# Altium project Common_Sensor_Box.PrjPCB (part 10 of 17)

## Sheet Sensor_Box_CAN_Switch.SchDoc: Title
size 420 x 297 mm; Author: G.Kasprowicz; CompanyName: WUT ISE; DrawnBy: G.Kasprowicz; Organization: WUT ISE; Address1: PW ISE; Address2: Nowowiejska 15/19 00-665 Warsaw; Address3: gkasprow@gmail.com; Revision: 1.0; SheetNumber: -; SheetTotal: -; ModifiedBy: -; CheckedDate: -; Title2: Title2; DivGrp: WUT ISE; Designer: G.Kasprowicz; ModifiedDate: -; ProjectName: Sensor Box
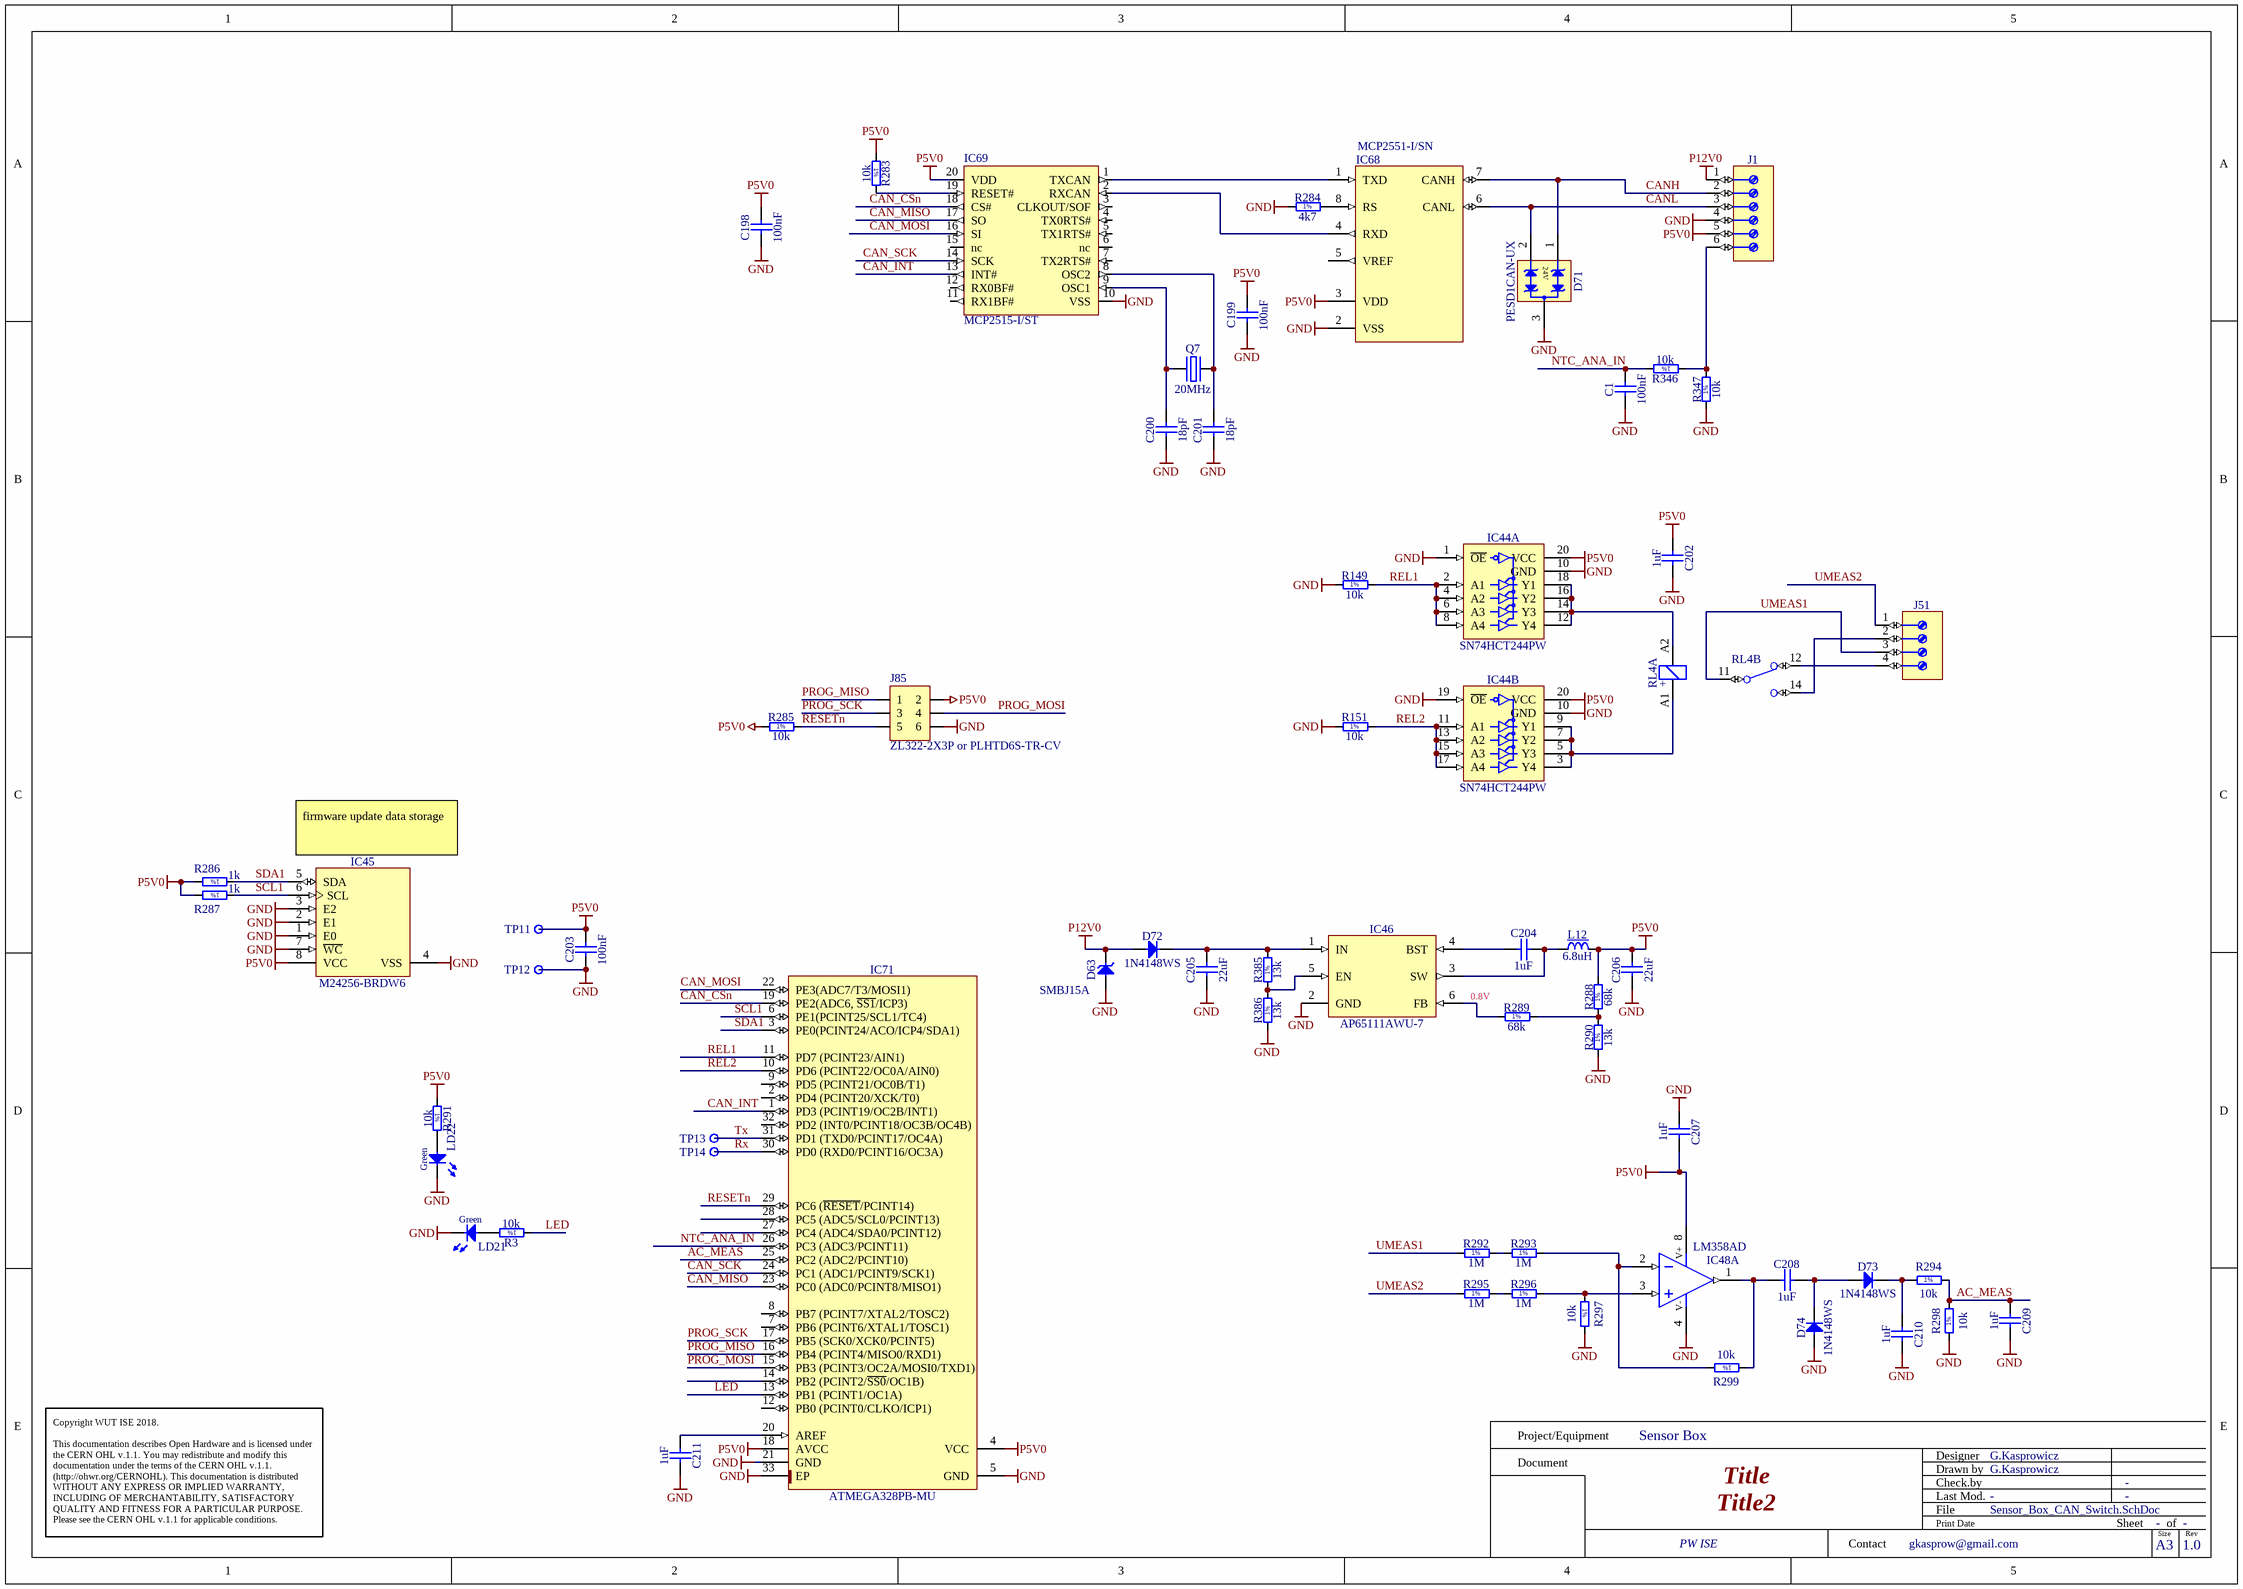
[diagram p15: Sensor_Box_CAN_Switch.SchDoc]

### Parts
C1  100nF  [CAPC1005X55N]
C198  100nF  [CAPC1005X55N]
C199  100nF  [CAPC1005X55N]
C200  18pF  [CAPC1005X55N]
C201  18pF  [CAPC1005X55N]
C202  1uF  [CAPC1005X55N]
C203  100nF  [CAPC1005X55N]
C204  1uF  [CAPC1005X55N]
C205  22uF  [CAPC1709X100N]
C206  22uF  [CAPC1709X100N]
C207  1uF  [CAPC1005X55N]
C208  1uF  [CAPC1005X55N]
C209  1uF  [CAPC1005X55N]
C210  1uF  [CAPC1005X55N]
C211  1uF  [CAPC1005X55N]
D63  SMBJ15A  [DIOM5336X265N]
D71  PESD1CAN-UX  [SOT95P237X112-3N]
D72  1N4148WS  [SODFL2512X100N]
D73  1N4148WS  [SODFL2512X100N]
D74  1N4148WS  [SODFL2512X100N]
IC44  SN74HCT244PW  [SOP65P640X120-20N]  (parts A,B of 2)
IC45  M24256-BRDW6  [SOP65P640X120-8N]
IC46  AP65111AWU-7  [SOT95P280X100-6N]
IC48  LM358AD  [SOIC127P600X175-8N]  (part A of 2)
IC68  MCP2551-I/SN  [SOIC127P600X175-8N]
IC69  MCP2515-I/ST  [SOP65P640X110-20N]
IC71  ATMEGA328PB-MU  [QFN50P500X500X100-33N-S325]
J1  (no value)  [PHOENIX_1725698]
J51  (no value)  [TYCO_282836-4]
J85  ZL322-2X3P or PLHTD6S-TR-CV  [ZL322-2X3P]
L12  6.8uH  [IND_WALSIN_WLPN3030]
LD21  Green  [LED_KINGBRIGHT_KPH-1608CGCK]
LD22  Green  [LED_KINGBRIGHT_KPH-1608CGCK]
Q7  20MHz  [XTAL1160X490X430]
R3  10k  [RESC1005X40N]
R149  10k  [RESC1005X40N]
R151  10k  [RESC1005X40N]
R283  10k  [RESC1005X40N]
R284  4k7  [RESC1005X40N]
R285  10k  [RESC1005X40N]
R286  1k  [RESC1005X40N]
R287  1k  [RESC1005X40N]
R288  68k  [RESC1005X40N]
R289  68k  [RESC1005X40N]
R290  13k  [RESC1005X40N]
R291  10k  [RESC1005X40N]
R292  1M  [RESC3216X65N]
R293  1M  [RESC3216X65N]
R294  10k  [RESC1005X40N]
R295  1M  [RESC3216X65N]
R296  1M  [RESC3216X65N]
R297  10k  [RESC1005X40N]
R298  10k  [RESC1005X40N]
R299  10k  [RESC1005X40N]
R346  10k  [RESC1005X40N]
R347  10k  [RESC1005X40N]
R385  13k  [RESC1005X40N]
R386  13k  [RESC1005X40N]
RL4  REL_TYCO_PE01  [REL_TYCO_PE01]  (value not drawn)  (parts A,B of 2)
TP11  Test Point  [TPS127]  (value not drawn)
TP12  Test Point  [TPS127]  (value not drawn)
TP13  Test Point  [TPS127]  (value not drawn)
TP14  Test Point  [TPS127]  (value not drawn)

### Nets
GND: C1.1 C198.1 C199.1 C200.1 C201.1 C202.2 C203.1 C205.1 C206.1 C207.1 C209.2 C210.2 C211.2 D63.2(A) D71.3(GND) D74.2(A) IC44.1(~{OE}) IC44.10(GND) IC44.19(~{OE}) IC45.1(E0) IC45.2(E1) IC45.3(E2) IC45.4(VSS) IC45.7(~{WC}) IC46.2(GND) IC48.4(V-) IC68.2(VSS) IC69.10(VSS) IC71.5(GND) IC71.21(GND) IC71.33(EP) J1.4 J85.6 LD21.1(C) LD22.1(C) R149.1 R151.1 R284.1 R290.1 R297.2 R298.1 R347.1 R386.1 TP12.1
P5V0: C198.2 C199.2 C202.1 C203.2 C206.2 C207.2 IC44.20(VCC) IC45.8(VCC) IC48.8(V+) IC68.3(VDD) IC69.20(VDD) IC71.4(VCC) IC71.18(AVCC) J1.5 J85.2 L12.2 R283.1 R285.1 R286.2 R287.2 R288.2 R291.1 TP11.1
P12V0: D63.1(C) D72.2(A) J1.1
AC_MEAS: C209.1 IC71.25(PC2_(ADC2/PCINT10)) R294.2 R298.2
CAN_CSn: IC69.18(CS#) IC71.19(PE2(ADC6,_~{SS1}/ICP3))
CAN_INT: IC69.13(INT#) IC71.1(PD3_(PCINT19/OC2B/INT1))
CAN_MISO: IC69.17(SO) IC71.23(PC0_(ADC0/PCINT8/MISO1))
CAN_MOSI: IC69.16(SI) IC71.22(PE3(ADC7/T3/MOSI1))
CAN_SCK: IC69.14(SCK) IC71.24(PC1_(ADC1/PCINT9/SCK1))
CANH: D71.1(I/O1) IC68.7(CANH) J1.2
CANL: D71.2(I/O2) IC68.6(CANL) J1.3
LED: IC71.13(PB1_(PCINT1/OC1A)) R3.1
NTC_ANA_IN: C1.2 IC71.26(PC3_(ADC3/PCINT11)) R346.2
PROG_MISO: IC71.16(PB4_(PCINT4/MISO0/RXD1)) J85.1
PROG_MOSI: IC71.15(PB3_(PCINT3/OC2A/MOSI0/TXD1)) J85.4
PROG_SCK: IC71.17(PB5_(SCK0/XCK0/PCINT5)) J85.3
REL1: IC44.2(A1) IC44.4(A2) IC44.6(A3) IC44.8(A4) IC71.11(PD7_(PCINT23/AIN1)) R149.2
REL2: IC44.11(A1) IC44.13(A2) IC44.15(A3) IC44.17(A4) IC71.10(PD6_(PCINT22/OC0A/AIN0)) R151.2
RESETn: IC71.29(PC6_(~{RESET}/PCINT14)) J85.5 R285.2
Rx: IC71.30(PD0_(RXD0/PCINT16/OC3A)) TP14.1
SCL1: IC45.6(SCL) IC71.6(PE1(PCINT25/SCL1/TC4)) R287.1
SDA1: IC45.5(SDA) IC71.3(PE0(PCINT24/ACO/ICP4/SDA1)) R286.1
Tx: IC71.31(PD1_(TXD0/PCINT17/OC4A)) TP13.1
UMEAS1: J51.3 R292.1 RL4.11(C)
UMEAS2: J51.1 R295.1
NetC200_2: C200.2 IC69.9(OSC1) Q7.1(OSC1)
NetC201_2: C201.2 IC69.8(OSC2) Q7.2(OSC2)
NetC204_1: C204.1 IC46.4(BST)
NetC204_2: C204.2 IC46.3(SW) L12.1
NetC205_2: C205.2 D72.1(C) IC46.1(IN) R385.2
NetC208_1: C208.1 IC48.1(OUT) R299.1
NetC208_2: C208.2 D73.2(A) D74.1(C)
NetC210_1: C210.1 D73.1(C) R294.1
NetC211_1: C211.1 IC71.20(AREF)
NetIC44_3: IC44.3(Y4) IC44.5(Y3) IC44.7(Y2) IC44.9(Y1) RL4.A1
NetIC44_12: IC44.12(Y4) IC44.14(Y3) IC44.16(Y2) IC44.18(Y1) RL4.A2
NetIC46_5: IC46.5(EN) R385.1 R386.2
NetIC46_6: IC46.6(FB) R289.1
NetIC48_2: IC48.2(IN-) R293.2 R299.2
NetIC48_3: IC48.3(IN+) R296.2 R297.1
NetIC68_1: IC68.1(TXD) IC69.1(TXCAN)
NetIC68_4: IC68.4(RXD) IC69.2(RXCAN)
NetIC68_8: IC68.8(RS) R284.2
NetIC69_19: IC69.19(RESET#) R283.2
NetJ1_6: J1.6 R346.1 R347.2
NetJ51_2: J51.2 RL4.14(NO)
NetJ51_4: J51.4 RL4.12(NC)
NetLD21_2: LD21.2(A) R3.2
NetLD22_2: LD22.2(A) R291.2
NetR288_1: R288.1 R289.2 R290.2
NetR292_2: R292.2 R293.1
NetR295_2: R295.2 R296.1

Not connected (* = marked no-connect by the designer): IC68 5(VREF); IC69 3(CLKOUT/SOF) 4(TX0RTS#) 5(TX1RTS#) 6(nc) 7(TX2RTS#) 11(RX1BF#) 12(RX0BF#) 15(nc); IC71 2(PD4_(PCINT20/XCK/T0)) 7(PB6_(PCINT6/XTAL1/TOSC1)) 8(PB7_(PCINT7/XTAL2/TOSC2)) 9(PD5_(PCINT21/OC0B/T1)) 12(PB0_(PCINT0/CLKO/ICP1)) 14(PB2_(PCINT2/~{SS0}/OC1B)) 27(PC4_(ADC4/SDA0/PCINT12)) 28(PC5_(ADC5/SCL0/PCINT13)) 32(PD2_(INT0/PCINT18/OC3B/OC4B))

### Notes on the sheet
- (near IC45) firmware update data storage
- 0.8V
- Project/Equipment
- Document
- Designer
- Drawn by
- Check.by
- Copyright WUT ISE 2018.
  This documentation describes Open Hardware and is licensed under the CERN OHL v.1.1. You may redistribute and modify this documentation under the terms of the CERN OHL v.1.1. (http://ohwr.org/CERNOHL). This documentation is distributed WITHOUT ANY EXPRESS OR IMPLIED WARRANTY, INCLUDING OF MERCHANTABILITY, SATISFACTORY QUALITY AND FITNESS FOR A PARTICULAR PURPOSE. Please see the CERN OHL v.1.1 for applicable conditions.
- Contact
- File
- Last Mod.
- Print Date
- Sheet
- Size
- A3
- of
- Rev
- (in symbol R0402_1K_1%_0.0625W_100PPM) 1%
- (in symbol R0402_4K7_1%_0.0625W_100PPM) 1%
- (in symbol R0402_10K_1%_0.0625W_100PPM) 1%
- (in symbol R0402_13K_1%_0.0625W_100PPM) 1%
- (in symbol R0402_68K_1%_0.0625W_100PPM) 1%
- (in symbol R1206_1M_1%_0.25W_100PPM) 1%
- (in symbol REL_TYCO_PE014F05, part A) +

### Library data of the parts
C1 C198 C199 C203 = CC0402_100NF_16V_10%_X5R: as C188#1 on sheet Sensor_Box_Smart_IO; Part Number: CC0402_100NF_16V_10%_X5R; Component Kind: Standard; Component Type: Standard; Pin Count: 2; Value: 100nF; Status: None; Manufacturer Part Number: CC0402_100NF_16V_10%_X5R; Case: 0402; Mounted: Yes; Socket: No; SMD: Yes; Sense: No; Manufacturer1 Example: MURATA; Manufacturer1 ComponentHeight: 0.55mm; HelpURL: \\cern.ch\dfs\Applications\Altium\Datasheets\CC0402_X5R_MURATA_GRM.pdf; Author: CERN DEM JLC; CreateDate: 10.12.2013; LatestRevisionDate: 10.12.2013
C200 C201 = CC0402_18PF_50V_5%_C0G: as C185 on sheet Sensor_Box_Smart_IO; Part Number: CC0402_18PF_50V_5%_C0G; Component Kind: Standard; Component Type: Standard; Pin Count: 2; Value: 18pF; Status: Preferred; Manufacturer Part Number: CC0402_18PF_50V_5%_C0G; Case: 0402; Mounted: Yes; Socket: No; SMD: Yes; Sense: No; Manufacturer1 Example: KEMET; Manufacturer1 ComponentHeight: 0.55mm; HelpURL: \\cern.ch\dfs\Applications\Altium\Datasheets\CC0805_C0G_KEMET_(Commercial Grade).pdf; Author: CERN DEM JLC; CreateDate: 04.10.2016; LatestRevisionDate: 04.10.2016
C202 C204 C207-C211 = CC0402_1UF_16V_10%_X5R: as C181-C183 on sheet Sensor_Box_Smart_IO; Part Number: CC0402_1UF_16V_10%_X5R; Component Kind: Standard; Component Type: Standard; Pin Count: 2; Value: 1uF; Status: Preferred; Manufacturer Part Number: CC0402_1UF_16V_10%_X5R; Case: 0402; Mounted: Yes; Socket: No; SMD: Yes; Sense: No; Manufacturer1 Example: TDK; Manufacturer1 ComponentHeight: 0.55mm; HelpURL: \\cern.ch\dfs\Applications\Altium\Datasheets\CC0402_X5R_TDK_C.pdf; Author: CERN DEM JLC; CreateDate: 25.10.2012; LatestRevisionDate: 25.10.2012
C205 C206 = CC0603_22UF_6.3V_20%_X5R: Non-polarised capacitor; Part Description: SMD Multilayer Chip Ceramic Capacitor; Manufacturer: GENERIC; Manufacturer1 Part Number: C1608X5R0J226M080AC; Voltage: 6.3V; TC: X5R; Tolerance: ±20%; Part Number: CC0603_22UF_6.3V_20%_X5R; Component Kind: Standard; Component Type: Standard; Pin Count: 2; Value: 22uF; Status: None; Manufacturer Part Number: CC0603_22UF_6.3V_20%_X5R; Case: 0603; Mounted: Yes; Socket: No; SMD: Yes; Sense: No; Manufacturer1 Example: TDK; Manufacturer1 ComponentHeight: 1mm; HelpURL: \\cern.ch\dfs\Applications\Altium\Datasheets\CC0603_X5R_TDK_C.pdf; Author: CERN DEM JLC; CreateDate: 16.12.2013; LatestRevisionDate: 13.09.2016
D63 = SMBJ15A: Zener Diode; Part Description: Uni-Directional Transient Voltage Suppressor Diode; Manufacturer: FAIRCHILD SEMICONDUCTOR; Voltage: 15V; Power: 600W; PressFit: No; Bonding: No; Part Number: SMBJ15A; Component Kind: Standard; Component Type: Standard; Device: SMBJ15A; PackageDescription: DO-214-AA/SMB Diode, Molded Body; 5.34mm L X 3.625mm W X 2.65mm H, IPC Medium Density; Manufacturer Part Number: SMBJ15A; Pin Count: 2; Case: DO-214AA; Mounted: Yes; Socket: No; SMD: Yes; Sense: No; ComponentHeight: 2.65mm; HelpURL: \\cern.ch\dfs\Applications\Altium\Datasheets\SMBJ.pdf; Author: CERN DEM JLC; CreateDate: 08.12.2008; LatestRevisionDate: 19.12.2011
D71 = D_TVS_PESD1CAN: as D35 on sheet Sensor_Box_Hub_OrangePi; Part Number: PESD1CAN-UX; Component Kind: Standard; Component Type: Standard; Device: PESD1CAN-UX; PackageDescription: SOT, 0.95mm, pitch; 3 pin,1.30mm W X 2.92mm L X 1.12mm H body, IPC Medium Density; Part Description: TVS Diode for CAN; Manufacturer Part Number: PESD1CAN-UX; Pin Count: 3; Case: SOT-23; Mounted: Yes; Socket: No; SMD: Yes; Sense: No; ComponentHeight: 1.12mm; HelpURL: \\cern.ch\dfs\Applications\Altium\Datasheets\SM712.TCT.pdf; Author: CERN DEM JLC; CreateDate: 03.09.2014; LatestRevisionDate: 13.01.2015
D72-D74 = 1N4148WS: as D56-D61 on sheet Sensor_Box_Smart_IO; Part Number: 1N4148WS; Component Kind: Standard; Component Type: Standard; Device: 1N4148WS; PackageDescription: SODFL Diode; 1.70mm W X 1.25mm L X 1.00mm H body, IPC Medium Density; Manufacturer Part Number: 1N4148WS; Pin Count: 2; Case: SOD-323F; Mounted: Yes; Socket: No; SMD: Yes; Sense: No; ComponentHeight: 1mm; HelpURL: \\cern.ch\dfs\Applications\Altium\Datasheets\1N4148WS.pdf; Author: CERN DEM JLC; CreateDate: 12.05.2011; LatestRevisionDate: 12.05.2011
IC44 = SN74HCT244PW: Octal Buffer/Driver with 3-State Ouputs; Part Description: Octal Buffer And Line Driver with 3-State Ouputs; Manufacturer: TEXAS INSTRUMENTS; PressFit: No; Bonding: No; Part Number: SN74HCT244PW; Component Kind: Standard; Component Type: Standard; Device: SN74HCT244PW; PackageDescription: SOP, 20-Leads, Body 6.5x4.4mm, Pitch 0.65mm, IPC Medium Density; Manufacturer Part Number: SN74HCT244PW; Pin Count: 20; Case: TSSOP20; Mounted: Yes; Socket: No; SMD: Yes; Sense: No; ComponentHeight: 1.2mm; Author: CERN DEM JLC; HelpURL: \\cern.ch\dfs\Applications\Altium\Datasheets\SN74HCT244PW.pdf; CreateDate: 11.10.2011; LatestRevisionDate: 11.10.2011
IC45 = MEM_M24256-BRDW6P: as IC76#1 on sheet Sensor_Box_Smart_IO; Part Number: M24256-BRDW6P; Component Kind: Standard; Component Type: Standard; Device: M24256-BRDW6; PackageDescription: SOP, 0.65mm pitch; 8 pin, 4.40mm W X 3.00mm L X 1.20mm H body, IPC Medium Density; Part Description: 256-Kbit Serial I²C Bus EEPROM; Manufacturer Part Number: M24256-BRDW6; Pin Count: 8; Case: TSSOP8; Mounted: Yes; Socket: No; SMD: Yes; Sense: No; ComponentHeight: 1.2mm; HelpURL: \\cern.ch\dfs\Applications\Altium\Datasheets\M24256-BRDW6P.pdf; Author: CERN DEM MR; CreateDate: 17.03.2016; LatestRevisionDate: 17.03.2016
IC46 = AP65111AWU-7: Light Load Improved 1.5A Synch DC/DC Buck Converter; Manufacturer: DIODES INCORPORATED; PressFit: No; Bonding: No; Part Number: AP65111AWU-7; Component Kind: Standard; Component Type: Standard; Device: AP65111AWU-7; PackageDescription: SOT23, 0.95mm pitch; 6 pin, 1.625mm W X 2.90mm L X 1.00mm H body, IPC Medium Density; Part Description: Light Load Improved 1.5A Synch DC/DC Buck Converter; Manufacturer Part Number: AP65111AWU-7; Pin Count: 6; Case: SOT23-6; Mounted: Yes; Socket: No; SMD: Yes; Sense: No; ComponentHeight: 1.1mm; HelpURL: \\cern.ch\dfs\Applications\Altium\Datasheets\AP65111AWU-7.pdf; Author: CERN DEM JLC; CreateDate: 20.03.2018; LatestRevisionDate: 20.03.2018
IC48 = LM358AD: as IC62 on sheet Sensor_Box_Smart_IO; Part Number: LM358AD; Component Kind: Standard; Component Type: Standard; Device: LM358AD; PackageDescription: SOIC 8, Pitch 1.27mm - Body 4x5mm, IPC Medium Density; Part Description: Dual Operational Amplifier; Manufacturer Part Number: LM358AD; Pin Count: 8; Case: SOIC8; Mounted: Yes; Socket: No; SMD: Yes; Sense: No; ComponentHeight: 1.75mm; Author: CERN DEM JLC; HelpURL: \\cern.ch\dfs\Applications\Altium\Datasheets\LM358AD.pdf; CreateDate: 02.12.2008; LatestRevisionDate: 13.04.2010
IC68 = IFC_MCP2551: as IC49 on sheet Sensor_Box_Hub_OrangePi; Part Number: MCP2551-I/SN; Component Kind: Standard; Component Type: Standard; Device: MCP2551-I/SN; PackageDescription: SOIC 8, Pitch 1.27mm - Body 4x5mm, IPC Medium Density; Part Description: High-Speed CAN Transceiver; Manufacturer Part Number: MCP2551-I/SN; Pin Count: 8; Case: SOIC8; Mounted: Yes; Socket: No; SMD: Yes; Sense: No; ComponentHeight: 1.75mm; Author: GK; CreateDate: 07.09.2016; LatestRevisionDate: 07.09.2016
IC69 = IFC_MCP2515_TSSOP: CAN Controller With SPI nterface; Manufacturer: Microchip; Manufacturer Part Number: MCP2515T-I/ST; Part Description: Stand-Alone CAN Controller with SPI Interface; Case: TSSOP20; Component Type: Standard; Device: MCP2515; Mounted: Yes; PackageDescription: TSSOP 20, Pitch 0.65mm - Body 4.5x6.5mm, IPC Medium Density; Part Number: MCP2515T-I/ST; Pin Count: 20; SMD: Yes
IC71 = UPC_ATMEGA328PB-MU: as IC81 on sheet Sensor_Box_Smart_IO; Part Number: ATMEGA328PB-MU; Component Kind: Standard; Component Type: Standard; Device: ATMEGA328PB-MU; PackageDescription: QFN, (MO-220-VHHD-2) 0.50mm pitch,square; 8 pin X 8 pin, 5mm X 5mm X 1.00mm H body (w/thermal tab 3.25 X 3.25mm),  IPC Medium Density; Manufacturer Part Number: ATMEGA328PB-MU; Pin Count: 33; Case: QFN32; Mounted: Yes; Socket: No; SMD: Yes; Sense: No; ComponentHeight: 1mm; HelpURL: \\cern.ch\dfs\Applications\Altium\Datasheets\ATMEGA328P-MU.pdf; Author: GK; CreateDate: 2011-02-08; LatestRevisionDate: 2014-07-02
J1 = PHOENIX_1725698: Terminal Block, 6 Positions, Screw Connection; Part Description: 6A, 63V, Terminal Block, Pitch 2.54mm, 6 Positions, Screw Connection; Manufacturer: PHOENIX CONTACT; Manufacturer Part Number: 1725698 (MPT 0,5/6-2,54); PressFit: No; Part Number: PHOENIX_1725698; Component Kind: Standard; Component Type: Standard; Pin Count: 6; Mounted: Yes; Socket: No; SMD: No; Sense: No; Status: None; ComponentHeight: 8.5mm; HelpURL: \\cern.ch\dfs\Applications\Altium\Datasheets\PHOENIX_1725698.pdf; Author: CERN DEM JMW; CreateDate: 07.11.2008; LatestRevisionDate: 26.04.2010
J51 = TYCO_282836-4: Terminal Block, 4 Positions, Screw Connection; Part Description: 15.5A, 300V, Terminal Block, Pitch 5mm, 4 Positions, Screw Connection; Manufacturer: TYCO ELECTRONICS; PressFit: No; Part Number: TYCO_282836-4; Component Kind: Standard; Component Type: Standard; Pin Count: 4; Mounted: Yes; Socket: No; SMD: No; Sense: No; Status: None; Manufacturer Part Number: 282836-4; ComponentHeight: 10mm; HelpURL: \\cern.ch\dfs\Applications\Altium\Datasheets\TYCO_282836-4.pdf; Author: CERN DEM JLC; CreateDate: 10.11.2014; LatestRevisionDate: 10.11.2014
J85 = CON_2x3 1.27 SMT Male: 1.27 mm dual row goldpin (Maritex)
L12 = IND_WLPN3030: 6,8uH; 900mA; 0,211Ω; 3x3x1,5mm; Part Number: IND_6.8UH_20%_WALSIN_WLPN303015M6R8PB; Part Description: Miniature Surface Mount Power Inductor (8200 Series); Manufacturer: WALSIN; Manufacturer Part Number: WLPN303015M6R8PB; Resistance: 0.21R; Tolerance: ±20%; Component Kind: Standard; Component Type: Standard; Pin Count: 2; Value: 6.8uH; Status: None; Power: 900mA; Mounted: Yes; Socket: No; SMD: Yes; Sense: No; ComponentHeight: 1.5; HelpURL: \\cern.ch\dfs\Applications\Altium\Datasheets\IND_MURATA-PS_8200.pdf; Author: GK; CreateDate: 11.07.2016; LatestRevisionDate: 11.07.2016
LD21 LD22 = LED_KINGBRIGHT_KPH-1608CGCK: as LD28 on sheet Sensor_Box_Smart_IO; Part Number: LED_KINGBRIGHT_KPH-1608CGCK; Component Kind: Standard; Component Type: Standard; Color: Green; PackageDescription: SMT Green LED, Case 0603, Body L 1.6 x W 0.8mm H 0.65mm; Manufacturer: KINGBRIGHT; Manufacturer Part Number: KPH-1608CGCK; Pin Count: 2; Mounted: Yes; Socket: No; SMD: Yes; Sense: No; ComponentHeight: 0.65mm; HelpURL: \\cern.ch\dfs\Applications\Altium\Datasheets\LED_KINGBRIGHT_KPH-1608CGCK.pdf; Author: CERN DEM JLC; CreateDate: 03.07.2017; LatestRevisionDate: 03.07.2017
Q7 = X_CRYSTAL_20M_HC49: Quartz Crystal 20MHz, 30ppm, 20pF; Part Number: SR PASSIVES 20M-49SMD-SR; Part Description: Tolerance:± 30ppm, Stability:± 50ppm, -10°C to +60°C, 20pF, Surface Mount Quartz Crystal, HC49/4HSMX Series; Manufacturer: SR PASSIVES; Manufacturer Part Number: 20M-49SMD-SR; PressFit: No; Bonding: No; Component Kind: Standard; Component Type: Standard; PackageDescription: HC49/4H SMX Case, SMD Cristal, Body 11.6x4.9mm; Value: 20MHz; Pin Count: 2; Mounted: Yes; Socket: No; SMD: Yes; Sense: No; ComponentHeight: 4.3mm; HelpURL: \\cern.ch\dfs\Applications\Altium\Datasheets\XTAL_IQD_LFXTAL003166.pdf; Author: GK; CreateDate: 19.04.2012; LatestRevisionDate: 07.11.2016
R3 R149 R151 R283 R285 R291 R346 R347 = R0402_10K_1%_0.0625W_100PPM: as R322#1 on sheet Sensor_Box_Smart_IO; Part Number: R0402_10K_1%_0.0625W_100PPM; Component Kind: Standard; Component Type: Standard; Pin Count: 2; Value: 10k; Status: Not Recommended; Power: 0.0625W; Tolerance: ±1%; Manufacturer Part Number: R0402_10K_1%_0.0625W_100PPM; Case: 0402; Mounted: Yes; Sense: No; Socket: No; SMD: Yes; Manufacturer1 Example: YAGEO PHYCOMP; Manufacturer1 ComponentHeight: 0.4mm; HelpURL: \\cern.ch\dfs\Applications\Altium\Datasheets\R0402_Phycomp_RC0402.pdf; Author: CERN DEM JLC; CreateDate: 03.12.2007; LatestRevisionDate: 17.10.2012
R284 = R0402_4K7_1%_0.0625W_100PPM: as R168 on sheet Sensor_Box_Hub_OrangePi; Part Number: R0402_4K7_1%_0.0625W_100PPM; Component Kind: Standard; Component Type: Standard; Pin Count: 2; Value: 4k7; Status: Not Recommended; Power: 0.0625W; Tolerance: ±1%; Manufacturer Part Number: R0402_4K7_1%_0.0625W_100PPM; Case: 0402; Mounted: Yes; Sense: No; Socket: No; SMD: Yes; Manufacturer1 Example: YAGEO PHYCOMP; Manufacturer1 ComponentHeight: 0.4mm; HelpURL: \\cern.ch\dfs\Applications\Altium\Datasheets\R0402_Phycomp_RC0402.pdf; Author: CERN DEM JLC; CreateDate: 03.12.2007; LatestRevisionDate: 17.10.2012
R286 R287 = R0402_1K_1%_0.0625W_100PPM: as R233 on sheet Sensor_Box_Smart_IO; Part Number: R0402_1K_1%_0.0625W_100PPM; Component Kind: Standard; Component Type: Standard; Pin Count: 2; Value: 1k; Status: Not Recommended; Power: 0.0625W; Tolerance: ±1%; Manufacturer Part Number: R0402_1K_1%_0.0625W_100PPM; Case: 0402; Mounted: Yes; Sense: No; Socket: No; SMD: Yes; Manufacturer1 Example: YAGEO PHYCOMP; Manufacturer1 ComponentHeight: 0.4mm; HelpURL: \\cern.ch\dfs\Applications\Altium\Datasheets\R0402_Phycomp_RC0402.pdf; Author: CERN DEM JLC; CreateDate: 03.12.2007; LatestRevisionDate: 17.10.2012
R288 R289 = R0402_68K_1%_0.0625W_100PPM: Resistor - 1%; Part Description: General Purpose Thick Film Chip Resistor; Manufacturer: GENERIC; Manufacturer1 Part Number: 232270676803L; TC: ±100ppm/°C; PressFit: No; Part Number: R0402_68K_1%_0.0625W_100PPM; Component Kind: Standard; Component Type: Standard; Pin Count: 2; Value: 68k; Status: Not Recommended; Power: 0.0625W; Tolerance: ±1%; Manufacturer Part Number: R0402_68K_1%_0.0625W_100PPM; Case: 0402; Mounted: Yes; Sense: No; Socket: No; SMD: Yes; Manufacturer1 Example: YAGEO PHYCOMP; Manufacturer1 ComponentHeight: 0.4mm; HelpURL: \\cern.ch\dfs\Applications\Altium\Datasheets\R0402_Phycomp_RC0402.pdf; Author: CERN DEM JLC; CreateDate: 03.12.2007; LatestRevisionDate: 17.10.2012
R290 R385 R386 = R0402_13K_1%_0.0625W_100PPM: Resistor - 1%; Part Description: General Purpose Thick Film Chip Resistor; Manufacturer: GENERIC; Manufacturer1 Part Number: 232270671303L; TC: ±100ppm/°C; PressFit: No; Part Number: R0402_13K_1%_0.0625W_100PPM; Component Kind: Standard; Component Type: Standard; Pin Count: 2; Value: 13k; Status: Not Recommended; Power: 0.0625W; Tolerance: ±1%; Manufacturer Part Number: R0402_13K_1%_0.0625W_100PPM; Case: 0402; Mounted: Yes; Sense: No; Socket: No; SMD: Yes; Manufacturer1 Example: YAGEO PHYCOMP; Manufacturer1 ComponentHeight: 0.4mm; HelpURL: \\cern.ch\dfs\Applications\Altium\Datasheets\R0402_Phycomp_RC0402.pdf; Author: CERN DEM JLC; CreateDate: 03.12.2007; LatestRevisionDate: 17.10.2012
R292 R293 R295 R296 = R1206_1M_1%_0.25W_100PPM: Resistor - 1%; Part Description: General Purpose Thick Film Chip Resistor; Manufacturer: GENERIC; Manufacturer1 Part Number: NRC12F1004TRF; Power: 0.25W; TC: ±100ppm/°C; PressFit: No; Part Number: R1206_1M_1%_0.25W_100PPM; Component Kind: Standard; Component Type: Standard; Pin Count: 2; Value: 1M; Status: Preferred; Tolerance: ±1%; Manufacturer Part Number: R1206_1M_1%_0.25W_100PPM; Case: 1206; Mounted: Yes; Sense: No; Socket: No; SMD: Yes; Manufacturer1 Example: NIC COMPONENT; Manufacturer1 ComponentHeight: 0.65mm; HelpURL: \\cern.ch\dfs\Applications\Altium\Datasheets\R1206_NIC_NRC.pdf; Author: CERN DEM JLC; CreateDate: 03.12.2007; LatestRevisionDate: 13.03.2008
R294 R297-R299 = R0402_10K_1%_0.0625W_100PPM: as R230 on sheet Sensor_Box_Smart_IO; Part Number: R0402_10K_1%_0.0625W_100PPM; Component Kind: Standard; Component Type: Standard; Pin Count: 2; Value: 10k; Status: Not recommended; Power: 0.0625W; Tolerance: ±1%; Manufacturer Part Number: R0402_10K_1%_0.0625W_100PPM; Case: 0402; Mounted: Yes; Socket: No; SMD: Yes; Manufacturer1 Example: YAGEO PHYCOMP; Manufacturer1 ComponentHeight: 0.4mm; HelpURL: \\cern.ch\dfs\Applications\Altium\Datasheets\R0402_Phycomp_RC0402.pdf; Author: CERN DEM JLC; CreateDate: 2007-12-03; LatestRevisionDate: 2012-10-17
RL4 = REL_TYCO_PE014F05: 1 form C (CO) General Purpose Low Power PCB Relay, PE Series; Part Description: 5A/250VAC 1 form C (CO) General Purpose Low Power PCB Relay, PE Series; Manufacturer: TYCO SCHRACK; Manufacturer Part Number: PE014F05 or 1-1415390-1; PressFit: No; Value: 5VDC; Part Number: REL_TYCO_PE014F05; Component Kind: Standard; Component Type: Standard; Pin Count: 5; PackageDescription: 1 form C (CO) General Purpose Low Power PCB Relay, PE Series, Body 20mm x 10mm; Mounted: Yes; Socket: No; SMD: No; Sense: No; Status: None; ComponentHeight: 10mm; HelpURL: \\cern.ch\dfs\Applications\Altium\Datasheets\REL_TYCO_PE014F05.pdf; Author: CERN DEM JLC; CreateDate: 20.03.2018; LatestRevisionDate: 20.03.2018
TP11-TP14 = SMD_PAD_1.27X1.27MM: as TP23 on sheet Sensor_Box_Smart_IO; Part Number: SMD_PAD_1.27X1.27MM; Component Kind: Standard (No BOM); Component Type: Standard (No BOM); Pin Count: 1; Family: Test Point; Socket: No; SMD: Yes; Sense: No; Status: None; ComponentHeight: 0mm; HelpURL: Undefined; Author: CERN DEM JLC; CreateDate: 12.01.2008; LatestRevisionDate: 12.01.2008; PackageDescription: 1.27mm x 1.27mm PCB Copper Area (SMD Test Point)